# Altium project node24.PrjPcb (part 1 of 5)
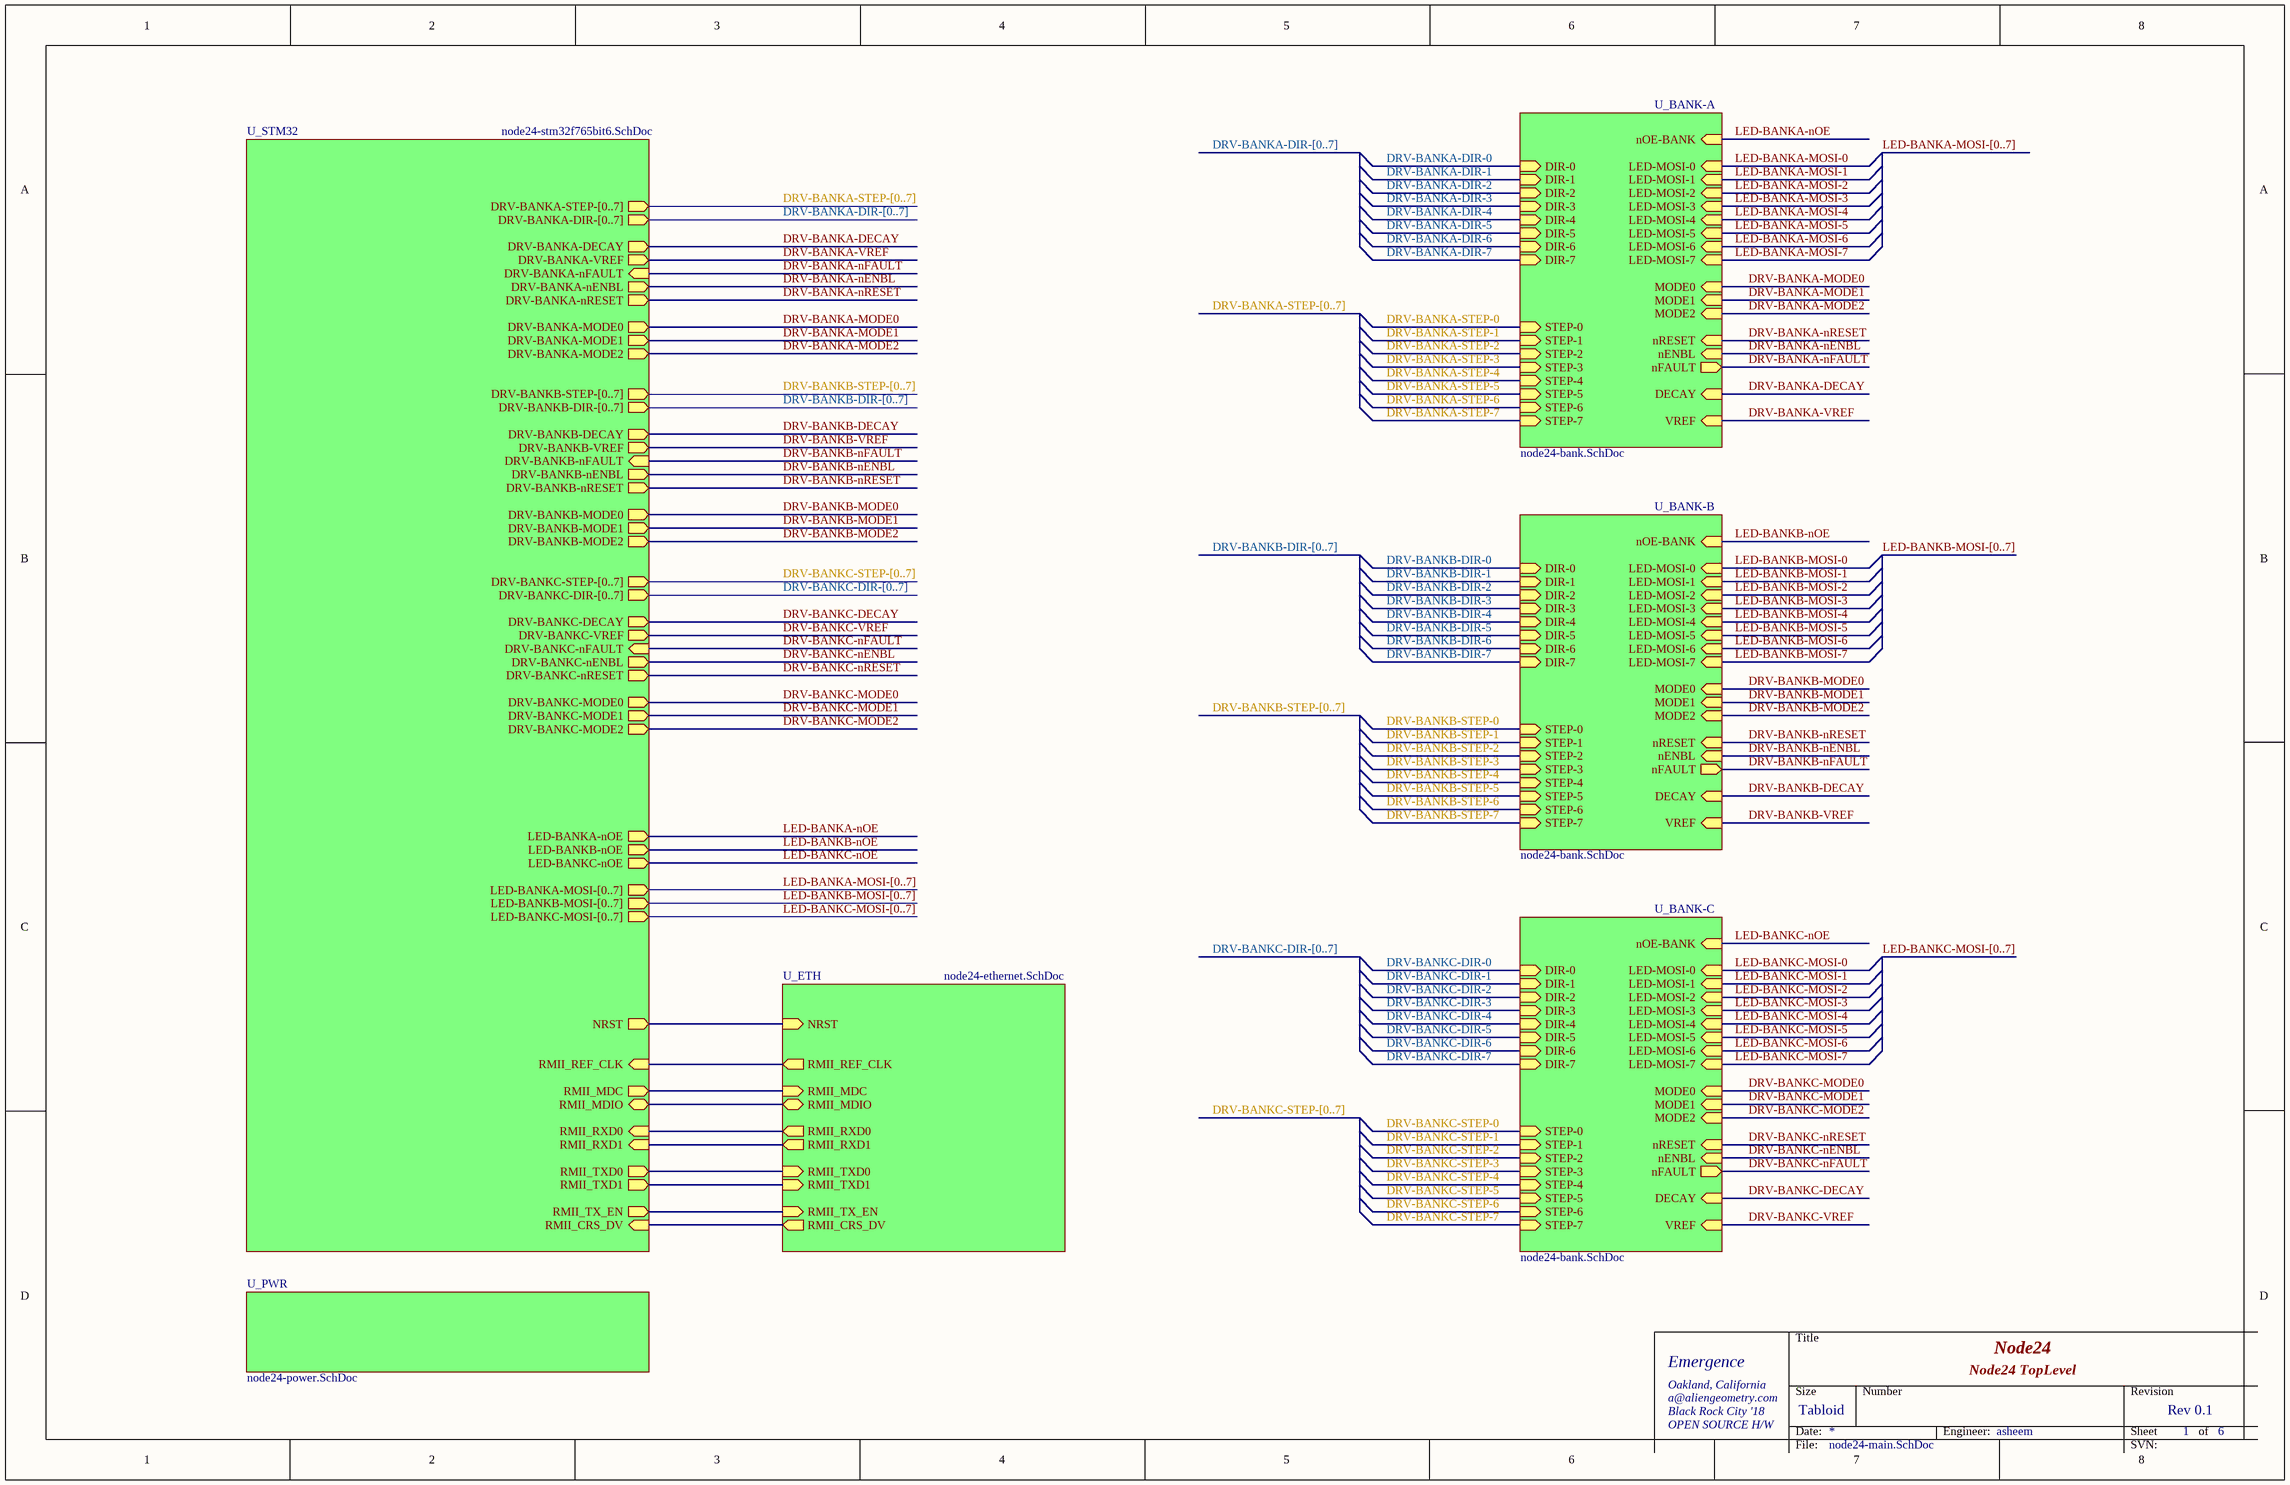
[diagram p0: node24-main.SchDoc]
ProjectTitle: Node24
6 sheets, 725 parts. Net scope: hierarchical (ports join the sheet entries above them; power ports are global).
Board file: node24.PcbDoc
Sheets:
  node24-main.SchDoc
    U_STM32 = node24-stm32f765bit6.SchDoc
    U_ETH = node24-ethernet.SchDoc
    U_PWR = node24-power.SchDoc
    U_BANK-A = node24-bank.SchDoc
      U_CH-0 = node24-channel.SchDoc
      U_CH-4 = node24-channel.SchDoc
      U_CH-1 = node24-channel.SchDoc
      U_CH-5 = node24-channel.SchDoc
      U_CH-2 = node24-channel.SchDoc
      U_CH-6 = node24-channel.SchDoc
      U_CH-3 = node24-channel.SchDoc
      U_CH-7 = node24-channel.SchDoc
    U_BANK-B = node24-bank.SchDoc
      U_CH-0 = node24-channel.SchDoc
      U_CH-4 = node24-channel.SchDoc
      U_CH-1 = node24-channel.SchDoc
      U_CH-5 = node24-channel.SchDoc
      U_CH-2 = node24-channel.SchDoc
      U_CH-6 = node24-channel.SchDoc
      U_CH-3 = node24-channel.SchDoc
      U_CH-7 = node24-channel.SchDoc
    U_BANK-C = node24-bank.SchDoc
      U_CH-0 = node24-channel.SchDoc
      U_CH-4 = node24-channel.SchDoc
      U_CH-1 = node24-channel.SchDoc
      U_CH-5 = node24-channel.SchDoc
      U_CH-2 = node24-channel.SchDoc
      U_CH-6 = node24-channel.SchDoc
      U_CH-3 = node24-channel.SchDoc
      U_CH-7 = node24-channel.SchDoc

## Sheet node24-main.SchDoc: Node24 TopLevel
size Tabloid; Author: Emergence Team; Engineer: asheem; Organization: Emergence; Address1: Oakland, California; Address2: a@aliengeometry.com; Address3: Black Rock City '18; Address4: OPEN SOURCE H/W; DocumentNumber: 1; Revision: Rev 0.1; SheetNumber: 1; SheetTotal: 6; SheetTitle: Node28 Main

### Sub-sheets
U_BANK-A = node24-bank.SchDoc: MODE0 (in), MODE1 (in), MODE2 (in), nENBL (in), VREF (in), nFAULT (out), nRESET (in), DECAY (in), DIR-0 (in), STEP-0 (in), DIR-1 (in), STEP-1 (in), DIR-2 (in), STEP-2 (in), DIR-3 (in), STEP-3 (in), DIR-5 (in), STEP-5 (in), DIR-6 (in), STEP-6 (in), DIR-7 (in), STEP-7 (in), DIR-4 (in), STEP-4 (in), LED-MOSI-3 (in), LED-MOSI-7 (in), LED-MOSI-6 (in), LED-MOSI-2 (in), LED-MOSI-1 (in), LED-MOSI-5 (in), LED-MOSI-4 (in), LED-MOSI-0 (in), nOE-BANK (in)
U_BANK-B = node24-bank.SchDoc: MODE0 (in), MODE1 (in), MODE2 (in), nENBL (in), VREF (in), nFAULT (out), nRESET (in), DECAY (in), DIR-0 (in), STEP-0 (in), DIR-1 (in), STEP-1 (in), DIR-2 (in), STEP-2 (in), DIR-3 (in), STEP-3 (in), DIR-5 (in), STEP-5 (in), DIR-6 (in), STEP-6 (in), DIR-7 (in), STEP-7 (in), DIR-4 (in), STEP-4 (in), LED-MOSI-3 (in), LED-MOSI-7 (in), LED-MOSI-6 (in), LED-MOSI-2 (in), LED-MOSI-1 (in), LED-MOSI-5 (in), LED-MOSI-4 (in), LED-MOSI-0 (in), nOE-BANK (in)
U_BANK-C = node24-bank.SchDoc: MODE0 (in), MODE1 (in), MODE2 (in), nENBL (in), VREF (in), nFAULT (out), nRESET (in), DECAY (in), DIR-0 (in), STEP-0 (in), DIR-1 (in), STEP-1 (in), DIR-2 (in), STEP-2 (in), DIR-3 (in), STEP-3 (in), DIR-5 (in), STEP-5 (in), DIR-6 (in), STEP-6 (in), DIR-7 (in), STEP-7 (in), DIR-4 (in), STEP-4 (in), LED-MOSI-3 (in), LED-MOSI-7 (in), LED-MOSI-6 (in), LED-MOSI-2 (in), LED-MOSI-1 (in), LED-MOSI-5 (in), LED-MOSI-4 (in), LED-MOSI-0 (in), nOE-BANK (in)
U_ETH = node24-ethernet.SchDoc: RMII_TXD0 (in), RMII_TX_EN (in), RMII_RXD0 (out), RMII_REF_CLK (out), RMII_CRS_DV (out), RMII_MDC (in), RMII_MDIO (bidir), NRST (in), RMII_TXD1 (in), RMII_RXD1 (out)
U_PWR = node24-power.SchDoc: no entries
U_STM32 = node24-stm32f765bit6.SchDoc: RMII_TXD0 (out), RMII_TX_EN (out), RMII_RXD0 (in), RMII_REF_CLK (in), RMII_CRS_DV (in), RMII_MDC (out), RMII_MDIO (bidir), RMII_TXD1 (out), RMII_RXD1 (in), NRST (out), DRV-BANKA-VREF (out), DRV-BANKA-DECAY (out), DRV-BANKA-nFAULT (in), DRV-BANKA-nENBL (out), DRV-BANKA-MODE0 (out), DRV-BANKA-MODE1 (out), DRV-BANKA-MODE2 (out), DRV-BANKB-DECAY (out), DRV-BANKB-VREF (out), DRV-BANKB-nFAULT (in), DRV-BANKB-nENBL (out), DRV-BANKB-MODE0 (out), DRV-BANKB-MODE1 (out), DRV-BANKB-MODE2 (out), DRV-BANKC-nENBL (out), DRV-BANKC-MODE0 (out), DRV-BANKC-MODE1 (out), DRV-BANKC-MODE2 (out), DRV-BANKC-DECAY (out), DRV-BANKC-VREF (out), DRV-BANKC-nFAULT (in), DRV-BANKB-STEP-[0..7] (out), DRV-BANKA-STEP-[0..7] (out), DRV-BANKB-DIR-[0..7] (out), DRV-BANKC-STEP-[0..7] (out), DRV-BANKA-DIR-[0..7] (out), DRV-BANKC-DIR-[0..7] (out), LED-BANKC-MOSI-[0..7] (out), LED-BANKB-MOSI-[0..7] (out), LED-BANKA-MOSI-[0..7] (out), LED-BANKC-nOE (out), LED-BANKB-nOE (out), LED-BANKA-nOE (out), DRV-BANKB-nRESET (out), DRV-BANKA-nRESET (out), DRV-BANKC-nRESET (out)

### Nets
DRV-BANKA-DECAY: sheet U_STM32/DRV-BANKA-DECAY, sheet U_BANK-A/DECAY
DRV-BANKA-MODE0: sheet U_STM32/DRV-BANKA-MODE0, sheet U_BANK-A/MODE0
DRV-BANKA-MODE1: sheet U_STM32/DRV-BANKA-MODE1, sheet U_BANK-A/MODE1
DRV-BANKA-MODE2: sheet U_STM32/DRV-BANKA-MODE2, sheet U_BANK-A/MODE2
DRV-BANKA-nENBL: sheet U_STM32/DRV-BANKA-nENBL, sheet U_BANK-A/nENBL
DRV-BANKA-nFAULT: sheet U_STM32/DRV-BANKA-nFAULT, sheet U_BANK-A/nFAULT
DRV-BANKA-nRESET: sheet U_STM32/DRV-BANKA-nRESET, sheet U_BANK-A/nRESET
DRV-BANKA-VREF: sheet U_STM32/DRV-BANKA-VREF, sheet U_BANK-A/VREF
DRV-BANKB-DECAY: sheet U_STM32/DRV-BANKB-DECAY, sheet U_BANK-B/DECAY
DRV-BANKB-MODE0: sheet U_STM32/DRV-BANKB-MODE0, sheet U_BANK-B/MODE0
DRV-BANKB-MODE1: sheet U_STM32/DRV-BANKB-MODE1, sheet U_BANK-B/MODE1
DRV-BANKB-MODE2: sheet U_STM32/DRV-BANKB-MODE2, sheet U_BANK-B/MODE2
DRV-BANKB-nENBL: sheet U_STM32/DRV-BANKB-nENBL, sheet U_BANK-B/nENBL
DRV-BANKB-nFAULT: sheet U_STM32/DRV-BANKB-nFAULT, sheet U_BANK-B/nFAULT
DRV-BANKB-nRESET: sheet U_STM32/DRV-BANKB-nRESET, sheet U_BANK-B/nRESET
DRV-BANKB-VREF: sheet U_STM32/DRV-BANKB-VREF, sheet U_BANK-B/VREF
DRV-BANKC-DECAY: sheet U_STM32/DRV-BANKC-DECAY, sheet U_BANK-C/DECAY
DRV-BANKC-MODE0: sheet U_STM32/DRV-BANKC-MODE0, sheet U_BANK-C/MODE0
DRV-BANKC-MODE1: sheet U_STM32/DRV-BANKC-MODE1, sheet U_BANK-C/MODE1
DRV-BANKC-MODE2: sheet U_STM32/DRV-BANKC-MODE2, sheet U_BANK-C/MODE2
DRV-BANKC-nENBL: sheet U_STM32/DRV-BANKC-nENBL, sheet U_BANK-C/nENBL
DRV-BANKC-nFAULT: sheet U_STM32/DRV-BANKC-nFAULT, sheet U_BANK-C/nFAULT
DRV-BANKC-nRESET: sheet U_STM32/DRV-BANKC-nRESET, sheet U_BANK-C/nRESET
DRV-BANKC-VREF: sheet U_STM32/DRV-BANKC-VREF, sheet U_BANK-C/VREF
ETH-CRS-DV: sheet U_STM32/RMII_CRS_DV, sheet U_ETH/RMII_CRS_DV
ETH-MDC: sheet U_STM32/RMII_MDC, sheet U_ETH/RMII_MDC
ETH-MDIO: sheet U_STM32/RMII_MDIO, sheet U_ETH/RMII_MDIO
ETH-REF-CLK: sheet U_STM32/RMII_REF_CLK, sheet U_ETH/RMII_REF_CLK
ETH-RXD0: sheet U_STM32/RMII_RXD0, sheet U_ETH/RMII_RXD0
ETH-RXD1: sheet U_STM32/RMII_RXD1, sheet U_ETH/RMII_RXD1
ETH-TX-EN: sheet U_STM32/RMII_TX_EN, sheet U_ETH/RMII_TX_EN
ETH-TXD0: sheet U_STM32/RMII_TXD0, sheet U_ETH/RMII_TXD0
ETH-TXD1: sheet U_STM32/RMII_TXD1, sheet U_ETH/RMII_TXD1
LED-BANKA-nOE: sheet U_STM32/LED-BANKA-nOE, sheet U_BANK-A/nOE-BANK
LED-BANKB-nOE: sheet U_STM32/LED-BANKB-nOE, sheet U_BANK-B/nOE-BANK
LED-BANKC-nOE: sheet U_STM32/LED-BANKC-nOE, sheet U_BANK-C/nOE-BANK
nRST: sheet U_STM32/NRST, sheet U_ETH/NRST

### Buses and harness runs
bus DRV-BANKA-DIR-[0..7]
bus DRV-BANKA-DIR-[0..7] = sheet U_STM32/DRV-BANKA-DIR-[0..7]
bus DRV-BANKA-STEP-[0..7]
bus DRV-BANKA-STEP-[0..7] = sheet U_STM32/DRV-BANKA-STEP-[0..7]
bus DRV-BANKB-DIR-[0..7]
bus DRV-BANKB-DIR-[0..7] = sheet U_STM32/DRV-BANKB-DIR-[0..7]
bus DRV-BANKB-STEP-[0..7]
bus DRV-BANKB-STEP-[0..7] = sheet U_STM32/DRV-BANKB-STEP-[0..7]
bus DRV-BANKC-DIR-[0..7]
bus DRV-BANKC-DIR-[0..7] = sheet U_STM32/DRV-BANKC-DIR-[0..7]
bus DRV-BANKC-STEP-[0..7]
bus DRV-BANKC-STEP-[0..7] = sheet U_STM32/DRV-BANKC-STEP-[0..7]
bus LED-BANKA-MOSI-[0..7]
bus LED-BANKA-MOSI-[0..7] = sheet U_STM32/LED-BANKA-MOSI-[0..7]
bus LED-BANKB-MOSI-[0..7]
bus LED-BANKB-MOSI-[0..7] = sheet U_STM32/LED-BANKB-MOSI-[0..7]
bus LED-BANKC-MOSI-[0..7]
bus LED-BANKC-MOSI-[0..7] = sheet U_STM32/LED-BANKC-MOSI-[0..7]

### Notes on the sheet
- Title
- Size
- Date:
- Tabloid
- Number
- Engineer:
- Revision
- Sheet
- of
- File:
- SVN: